# Altium project LM2577 - LM2596 Module.PrjPcb
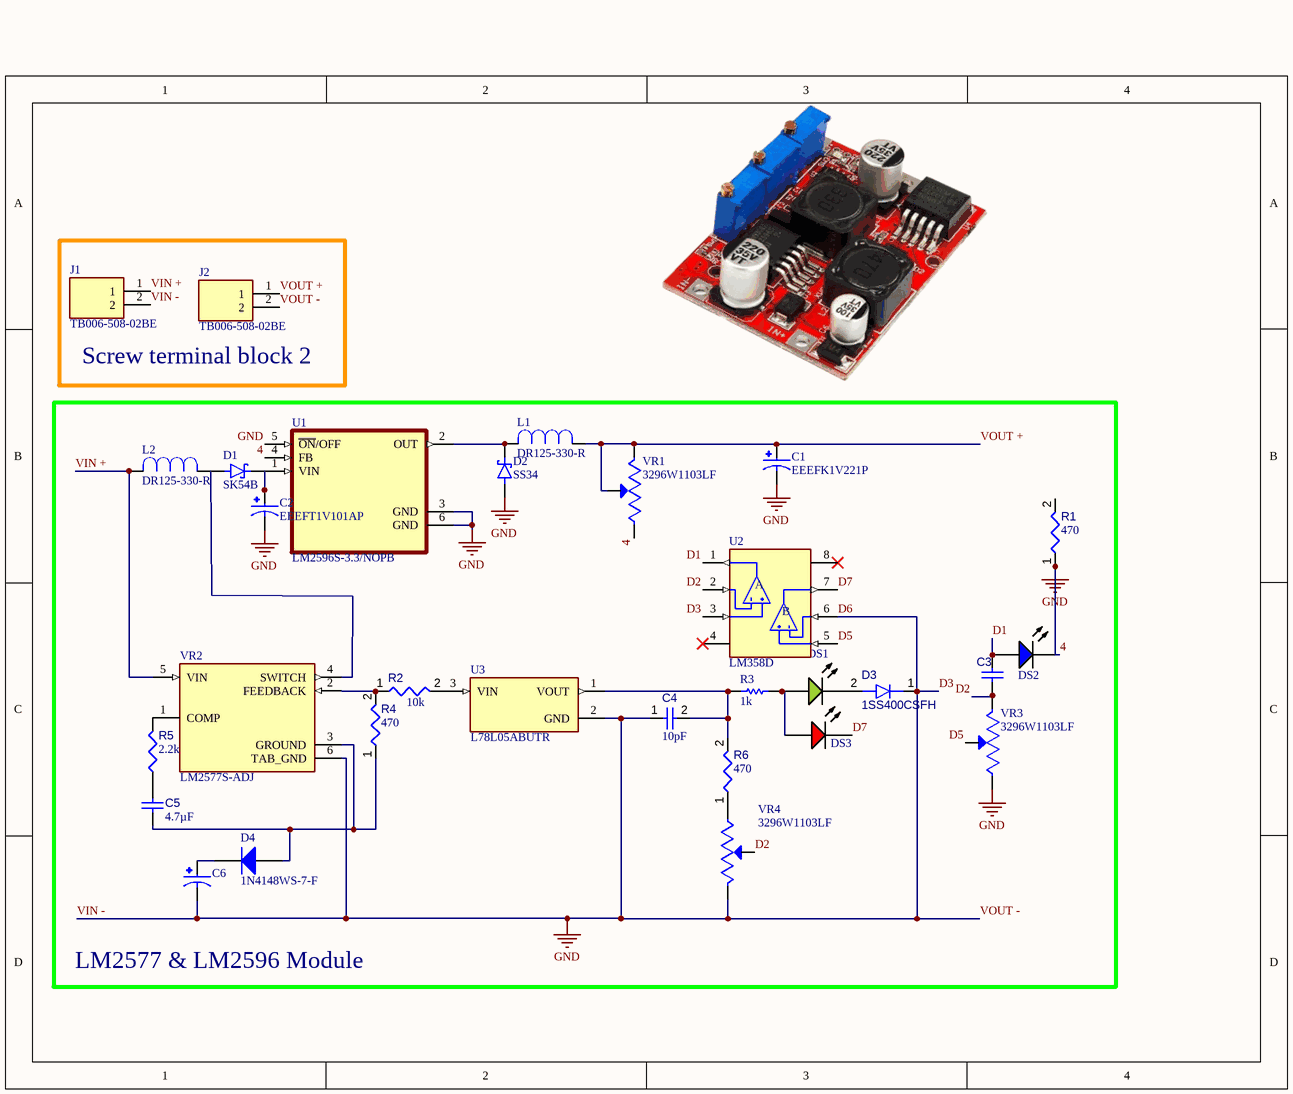
[diagram p0: Sheet1.SchDoc]
1 sheet, 30 parts. Net scope: global (net labels, ports and power ports of the same name join across sheets).
Board file: PCB1.PcbDoc

## Sheet Sheet1.SchDoc
size A; SheetNumber: 1; SheetTotal: 1

### Parts
C1  EEEFK1V221P  [CAP_EEEFK1V221P]
C2  EEEFT1V101AP  [CAP_EEEFT1V101AP]
C3  Capacitor 10 pF +/- 0.25 pF 50 V 0603  [CAPC1608X87X35NL15T15]  (value not drawn)
C4  value 10pF  [CAPC1608X87X35NL15T15]  (hidden comment: Capacitor 10 pF +/- 0.25 pF 50 V 0603)
C5  value 4.7µF  [CAPC0805(2012)145_L]  (hidden comment: Capacitor 4.7µF +/-40% 25V 0805)
C6  EEEFK1V221P  [CAP_EEEFK1V221P]  (value not drawn)
D1  SK54B  [DIO_SK54B]
D2  SS34  [DIO_SS34]
D3  1SS400CSFH  [ROHM-VMN2-2_V]
D4  1N4148WS-7-F  [DIOD-SOD323-2-A_V]
DS1  19-217-G7C-AN1P2-3T  [EVRL-0603-2_V]  (value not drawn)
DS2  19-217/BHC-ZL1M2RY/3T  [EVRL-0603-2_V]  (value not drawn)
DS3  19-217/R6C-AL1M2VY/3T  [EVRL-0603-2_V]  (value not drawn)
J1  TB006-508-02BE  [CUI_TB006-508-02BE]
J2  TB006-508-02BE  [CUI_TB006-508-02BE]
L1  DR125-330-R  [INDM125125X600N]
L2  DR125-330-R  [INDM125125X600N]
R1  value 470  [RESC0805(2012)_L]  (hidden comment: Resistor 470R +/-5% 0805 125 mW)
R2  value 10k  [RESC0402(1005)_L]  (hidden comment: 10KR2F)
R3  value 1k  [RESC1005X40X25ML05T05]  (hidden comment: Resistor 1k +/-1% 0402 100 mW)
R4  value 470  [RESC0805(2012)_L]  (hidden comment: Resistor 470R +/-5% 0805 125 mW)
R5  value 2.2k  [RESC0402(1005)_L]  (hidden comment: Resistor 2K2  +/-5 % 0402 63 mW)
R6  value 470  [RESC0805(2012)_L]  (hidden comment: Resistor 470R +/-5% 0805 125 mW)
U1  LM2596S-3.3/NOPB  [VREG_LM2596S-3.3/NOPB]
U2  LM358D  [SOIC127P599X175-8N]
U3  L78L05ABUTR  [VREG_L78L05ABUTR]
VR1  3296W1103LF  [TRIM_3296W1103LF]
VR2  LM2577S-ADJ  [TO170P1524X483-6N]
VR3  3296W1103LF  [TRIM_3296W1103LF]
VR4  3296W1103LF  [TRIM_3296W1103LF]

### Blocks framed on the sheet
Screw terminal block 2: J1 J2
LM2577 & LM2596 Module: C1-C6 D1-D4 DS1-DS3 L1 L2 R1-R6 U1-U3 VR1-VR4

### Nets
4: C1.2 C2.2 C4.1 C6.2 D2.A D3.1(K) DS2.2(K) J1.2 J2.2 R1.1 U1.3(GND) U1.4(FB) U1.5(~{ON}/OFF) U1.6(GND) U2.3(IN1+) U2.6(IN2-) U3.2(GND) VR1.1(CCW) VR2.6(TAB_GND) VR3.1(CCW) VR4.3(CW)  [also labelled D3, D6, GND, VIN -, VOUT -]
D1: C3.2 DS2.1(A) U2.1(OUT1)
D2: C3.1 U2.2(IN1-) VR3.3(CW) VR4.2(WIPER)
D5: U2.5(IN2+) VR3.2(WIPER)
D7: DS3.2(K) U2.7(OUT2)
VIN +: J1.1 L2.2 VR2.5(VIN)
VOUT +: C1.1 J2.1 L1.1 VR1.2(WIPER) VR1.3(CW)
NetC2_1: C2.1 D1.C(K) U1.1(VIN)
NetC4_2: C4.2 R3.1 R6.2 U3.1(VOUT)
NetC5_1: C5.1 D4.1(A) R4.1 VR2.3(GROUND)
NetC5_2: C5.2 R5.1
NetC6_1: C6.1 D4.2(K)
NetD1_A: D1.A L2.1 VR2.4(SWITCH)
NetD2_C: D2.C(K) L1.2 U1.2(OUT)
NetD3_2: D3.2(A) DS1.2(K)
NetDS1_1: DS1.1(A) DS3.1(A) R3.2
NetR2_1: R2.1 R4.2 VR2.2(FEEDBACK)
NetR2_2: R2.2 U3.3(VIN)
NetR5_2: R5.2 VR2.1(COMP)
NetR6_1: R6.1 VR4.1(CCW)

Not connected (* = marked no-connect by the designer): R1 2; U2 4(V-)* 8(V+)*

### Notes on the sheet
- (in symbol LM358D) A; B

### Library data of the parts
C1 C6 = EEEFK1V221P: 220ÂµF 35V Aluminum Electrolytic Capacitors Radial, Can - SMD 2000 Hrs @ 105Â°C; MF: Panasonic; SnapEDA_Link: https://www.snapeda.com/parts/EEEFK1V221P/Panasonic/view-part/?ref=snap; Package: RADIAL-2 Panasonic; Value: *; MP: EEEFK1V221P; Check_prices: https://www.snapeda.com/parts/EEEFK1V221P/Panasonic/view-part/?ref=eda
C2 = EEEFT1V101AP: 100ÂµF 35V Aluminum Electrolytic Capacitors Radial, Can - SMD 260mOhm @ 100kHz 2000 Hrs @ 105Â°C; MF: Panasonic; MP: EEE-FT1V101AP; SnapEDA_Link: https://www.snapeda.com/parts/EEE-FT1V101AP/Panasonic+Electronic+Components/view-part/?ref=snap; Package: RADIAL-2 Panasonic; Value: *; Check_prices: https://www.snapeda.com/parts/EEE-FT1V101AP/Panasonic+Electronic+Components/view-part/?ref=eda
C3 = CMP-001-00012-6: Chip Capacitor, 10 pF, +/- 0.25 pF, 50 V, 0603 (1608 Metric); Value: 10pF; Tolerance: 0.25%; Capacitor Type: Ceramic; Voltage Rating: 50V; Max Operating Temperature: 125°C; RoHS Compliant: True; Mounting Technology: SM; Pins: 2; Case/Package: 0603; Min Operating Temperature: -55°C
C4 = CMP-001-00012-6: Chip Capacitor, 10 pF, +/- 0.25 pF, 50 V, 0603 (1608 Metric); Tolerance: 0.25%; Capacitor Type: Ceramic; Voltage Rating: 50V; Max Operating Temperature: 125°C; RoHS Compliant: True; Mounting Technology: SM; Pins: 2; Case/Package: 0603; Min Operating Temperature: -55°C
C5 = CMP-001-00080-4: Chip Capacitor, 4.7µF +/-40%, 25V, 0805, Thickness 1.45 mm; Tolerance: 20%; Voltage Rating: 25V; Min Operating Temperature: -55°C; Max Operating Temperature: 85°C; Pins: 2; Mounting Technology: SMT; Case/Package: 0805
D1 = SK54B: 5A, 40V, Schottky Rectifier; MF: Taiwan Semiconductor; SnapEDA_Link: https://www.snapeda.com/parts/SK54B/Taiwan+Semiconductor/view-part/?ref=snap; Package: SMB-2 Taiwan Semiconductor; Value: *; MP: SK54B; Check_prices: https://www.snapeda.com/parts/SK54B/Taiwan+Semiconductor/view-part/?ref=eda
D2 = SS34: 3A, 40V, Schottky Rectifier; MF: Taiwan Semiconductor; SnapEDA_Link: https://www.snapeda.com/parts/SS34/Taiwan+Semiconductor/view-part/?ref=snap; Package: DO-214AB-2 Taiwan Semiconductor; Value: *; MP: SS34; Check_prices: https://www.snapeda.com/parts/SS34/Taiwan+Semiconductor/view-part/?ref=eda
D3 = CMP-004-00022-3: Switching Diode (High Speed Switching), 80 V, 100 mA, 2-Pin SOD-923, RoHS, Tape and Reel; Pins: 2; Mounting Technology: SMT
D4 = CMP-004-00002-2: Fast Switching Diode, 75 V, 0.3 A, -65 to 150 degC, 2-Pin SOD323, RoHS, Tape and Reel; Manufacturer: Diodes Inc; Peak Reverse Current: 1uA; Max Surge Current: 2A; Elements: 1; Forward Current: 300mA; Recovery Time: 4ns; Forward Voltage: 1.25V; Datasheet Version: Rev. 25-2, 03/2016; Case/Package: SOD; Min Operating Temperature: -65°C; RoHS Compliant: True; Max Operating Temperature: 150°C; Manufacturer URL: http://www.diodes.com/; Pins: 2; Package Quantity: 3000; Datasheet URL: http://www.diodes.com/datasheets/ds30097.pdf; Packaging: TapeandReel; Package Description: 2-Pin Small Outline Diode, Body 1.7 x 1.3 mm; Mounting Technology: SM; Package Reference: SOD323-2
DS1 = CMP-007-00002-2: Chip LED, Yellow-Green, 5 V, 25 mA, -40 to 85 degC, 2-Pin SMD (0603), RoHS, Tape and Reel; Manufacturer: Everlight Electronics; Forward Voltage: 2V; Lens Style: Clear; Viewing Angle: 120degrees; Colour: Green; Mounting Technology: SM; Datasheet Version: Rev. 1, 04/2006; Package Description: 2-Pin Surface Mount Device, Body 1.6 x 0.8 mm; RoHS Compliant: True; Package Reference: 0603; Pins: 2; Manufacturer URL: http://www.everlight.com/; Datasheet URL: https://datasheet.ciiva.com/48679/19-217-g7c-an1p2-3t-48679179.pdf; Case/Package: 0603
DS2 = CMP-007-00003-2: Chip LED, Blue, 5 V, 25 mA, -40 to 85 degC, 2-Pin SMD (0603), RoHS, Tape and Reel; Manufacturer: Everlight Electronics; Luminous Intensity: 28.5mcd; Viewing Angle: 120degrees; Forward Current: 25mA; Lens Style: Diffused; Forward Voltage: 3V; Pins: 2; Max Operating Temperature: 85°C; Manufacturer URL: http://www.everlight.com/; Datasheet URL: https://datasheet.ciiva.com/26901/getdatasheetpartid-420616-26901324.pdf; Package Reference: 0603; RoHS Compliant: True; Packaging: TapeandReel; Package Description: 2-Pin Surface Mount Device, Body 1.6 x 0.8 mm; Mounting Technology: SM; Datasheet Version: Rev. 1.0, 03/2003; Min Operating Temperature: -40°C; Case/Package: 0603; Colour: Blue
DS3 = CMP-007-00004-2: Chip LED, Red, 5 V, 25 mA, -40 to 85 degC, 2-Pin SMD (0603), RoHS, Tape and Reel; Manufacturer: Everlight Electronics; Forward Voltage: 2.2V; Lens Style: Clear; Package Reference: 0603; Datasheet Version: Rev. 1, 01/2005; Mounting Technology: SM; RoHS Compliant: False; Datasheet URL: https://datasheet.ciiva.com/4688/el-19-217-r6c-al1m2vy-3tpdf-187026-4688713.pdf; Case/Package: 0603; Colour: Red; Manufacturer URL: http://www.everlight.com/; Package Description: 2-Pin Surface Mount Device, Body 1.6 x 0.8 mm
J1 J2 = TB006-508-02BE: 2~24 Poles, Screw Type, Horizontal, 5.08 Pitch, 26~14 (AWG), Terminal Block Connector; MF: Same Sky; SnapEDA_Link: https://www.snapeda.com/parts/TB006-508-02BE/Same+Sky/view-part/?ref=snap; Package: None; Value: *; MP: TB006-508-02BE; Check_prices: https://www.snapeda.com/parts/TB006-508-02BE/Same+Sky/view-part/?ref=eda
L1 L2 = DR125-330-R: Inductor, Wirewound, Shielded, 33uH, 50.5mOhm, 3.28A, Surface Mount, DR Series | Eaton Electronics DR125-330-R; SnapEDA_Link: https://www.snapeda.com/parts/DR125-330-R/Eaton/view-part/?ref=snap; Package: Non Standard Coiltronics / Eaton; Value: *; MF: Eaton; MP: DR125-330-R; Check_prices: https://www.snapeda.com/parts/DR125-330-R/Eaton/view-part/?ref=eda
R1 R4 R6 = CMP-009-00122-3: Chip Resistor, 470 Ohms, +/-5%, 125 mW, -55 to 155 degC, 0805; Tolerance: 5%; Power: 125mW; Max Operating Temperature: 155°C; Case/Package: 0805; Pins: 2; Min Operating Temperature: -55°C
R2 = CMP-009-00066-2: 10K 0.063W 1% 0402 (1005 Metric)  SMD; Power: 63mW; Case/Package: 0402; Mounting Technology: SMT; Pins: 2; Tolerance: 1%
R3 = CMP-009-00009-5: Chip Resistor, 1 KOhm, +/- 1%, 0.1 W, -55 to 155 degC, 0402 (1005 Metric); Power: 100mW; Voltage Rating: 50V; Min Operating Temperature: -55°C; Max Operating Temperature: 155°C; RoHS Compliant: True; Mounting Technology: SM; Pins: 2; Tolerance: 1%; Case/Package: 0402
R5 = CMP-009-00166-3: Chip Resistor, 2,2 kOhms, +/-5 %, 63 mW, -55 to 155 degC, 0402; Power: 63mW; Tolerance: 5%; Pins: 2; Min Operating Temperature: -55°C; Max Operating Temperature: 155°C; Case/Package: 0402
U1 = LM2596S-3.3/NOPB: SIMPLE SWITCHERÂ® 4.5V to 40V, 3A Low Component Count Step-Down Regulator 5-DDPAK/TO-263; MF: Texas Instruments; SnapEDA_Link: https://www.snapeda.com/parts/LM2596S-3.3/Texas+Instruments/view-part/?ref=snap; Package: TO-263-5 Texas Instruments; Value: *; MP: LM2596S-3.3; Check_prices: https://www.snapeda.com/parts/LM2596S-3.3/Texas+Instruments/view-part/?ref=eda
U2 = LM358D: Op Amp Dual Low Power Amplifier Â±15V/30V 8-Pin SO N Tube; MF: STMicroelectronics; SnapEDA_Link: https://www.snapeda.com/parts/LM358D/STMicroelectronics/view-part/?ref=snap; Package: None; Value: *; MP: LM358D; Check_prices: https://www.snapeda.com/parts/LM358D/STMicroelectronics/view-part/?ref=eda
U3 = L78L05ABUTR: Linear Voltage Regulator IC Positive Fixed 1 Output 100mA SOT-89-3; MF: STMicroelectronics; SnapEDA_Link: https://www.snapeda.com/parts/L78L05ABUTR/STMicroelectronics/view-part/?ref=snap; Package: SOT-89-3 STMicroelectronics; Value: *; MP: L78L05ABUTR; Check_prices: https://www.snapeda.com/parts/L78L05ABUTR/STMicroelectronics/view-part/?ref=eda
VR1 VR3 VR4 = 3296W1103LF: Trimmer, Potentiometer 10kohm 25turn Thd; MF: Bourns; Package: None; MP: 3296W1103LF; Check_prices: https://www.snapeda.com/parts/3296W1103LF/Bourns/view-part/2487625/?ref=eda; Availability: Unavailable; Price: None; Value: *; SnapEDA_Link: https://www.snapeda.com/parts/3296W1103LF/Bourns/view-part/2487625/?ref=snap
VR2 = LM2577S-ADJ: SIMPLE SWITCHERÂ® 3.5V to 40V, 3A Low Component Count Step-Up Regulator 5-DDPAK/TO-263 -40 to 125; MF: Texas Instruments; SnapEDA_Link: https://www.snapeda.com/parts/LM2577S-ADJ/Texas+Instruments/view-part/?ref=snap; Package: TO-263-5 Texas Instruments; Value: *; MP: LM2577S-ADJ; Check_prices: https://www.snapeda.com/parts/LM2577S-ADJ/Texas+Instruments/view-part/?ref=eda